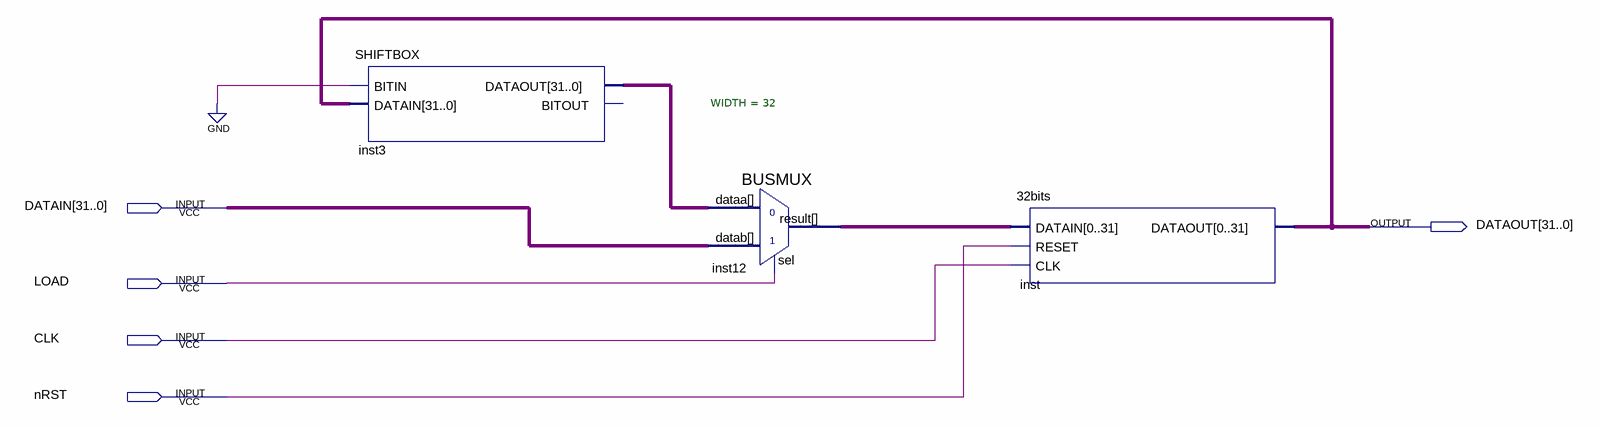
[diagram p0: schematic sheet]
// Quartus schematic REGISTRODESP32.bdf as structural Verilog: 3 symbols, 5 pins
module REGISTRODESP32 (
  input  [31:0] DATAIN,
  input  LOAD,
  input  CLK,
  input  nRST,
  output [31:0] DATAOUT
);

  wire [31:0] inst3_dataout, inst12_result;

  SHIFTBOX inst3 (.BITIN(1'b0), .DATAIN(DATAOUT), .DATAOUT(inst3_dataout));  // open: BITOUT
  BUSMUX #(.WIDTH(32)) inst12 (.datab(DATAIN), .sel(LOAD), .dataa(inst3_dataout), .result(inst12_result));
  \32bits  inst (.DATAIN(inst12_result), .RESET(nRST), .CLK(CLK), .DATAOUT(DATAOUT));
endmodule
